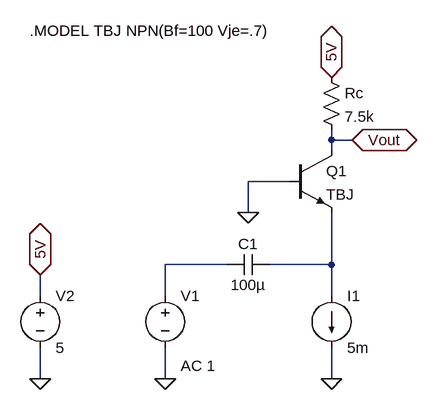
[diagram p0: schematic Draft1.asc]
Draft1.asc, the LTspice schematic file:
Version 4
SHEET 1 880 680
WIRE 192 176 192 160
WIRE 224 176 192 176
WIRE 192 192 192 176
WIRE 128 240 64 240
WIRE 64 288 64 240
WIRE 32 368 -64 368
WIRE 192 368 192 288
WIRE 192 368 96 368
WIRE -256 416 -256 384
WIRE -64 416 -64 368
WIRE 192 416 192 368
WIRE -256 544 -256 496
WIRE -64 544 -64 496
WIRE 192 544 192 496
FLAG 192 80 5V
IOPIN 192 80 BiDir
FLAG 64 288 0
FLAG -64 544 0
FLAG 192 544 0
FLAG -256 544 0
FLAG -256 384 5V
IOPIN -256 384 BiDir
FLAG 224 176 Vout
IOPIN 224 176 BiDir
SYMBOL res 176 64 R0
SYMATTR InstName Rc
SYMATTR Value 7.5k
SYMBOL voltage -64 400 R0
WINDOW 3 24 96 Invisible 2
WINDOW 123 24 124 Left 2
WINDOW 39 0 0 Left 0
SYMATTR InstName V1
SYMATTR Value 0
SYMATTR Value2 AC 1
SYMBOL npn 128 192 R0
SYMATTR InstName Q1
SYMATTR Value TBJ
SYMBOL current 192 416 R0
WINDOW 123 0 0 Left 0
WINDOW 39 0 0 Left 0
SYMATTR InstName I1
SYMATTR Value 5m
SYMBOL cap 32 384 R270
WINDOW 0 32 32 VTop 2
WINDOW 3 0 32 VBottom 2
SYMATTR InstName C1
SYMATTR Value 100µ
SYMBOL voltage -256 400 R0
WINDOW 123 0 0 Left 0
WINDOW 39 0 0 Left 0
SYMATTR InstName V2
SYMATTR Value 5
TEXT -272 8 Left 2 !.MODEL TBJ NPN(Bf=100 Vje=.7)

The netlist it stands for:
* Draft1.asc
Rc 5V Vout 7.5k
V1 N001 0 0 AC 1
Q1 Vout 0 N002 0 TBJ
I1 N002 0 5m
C1 N001 N002 100µ
V2 5V 0 5
.model NPN NPN
.model PNP PNP
.lib standard.bjt
.MODEL TBJ NPN(Bf=100 Vje=.7)
.backanno
.end